# Altium schematic sheet 02 BLOCK DIAGRAM.SchDoc
size A2; ApprovedBy: DNP; CheckedBy: DNP; Author: DNP; CompanyName: Google LLC; DrawnBy: DNP; Organization: Google LLC; Address1: 1600 Amphitheatre Parkway; Address2: Mountain View, CA 94043; Address3: DNP; Address4: DNP; DocumentNumber: 2; SheetNumber: 2; SheetTotal: 17; VersionControl_RevNumber: DNP; IsUserConfigurable: DNP; Time: DNP; ImagePath: DNP; Rule: DNP; ProjectName: Enterprise; Application_BuildNumber: DNP
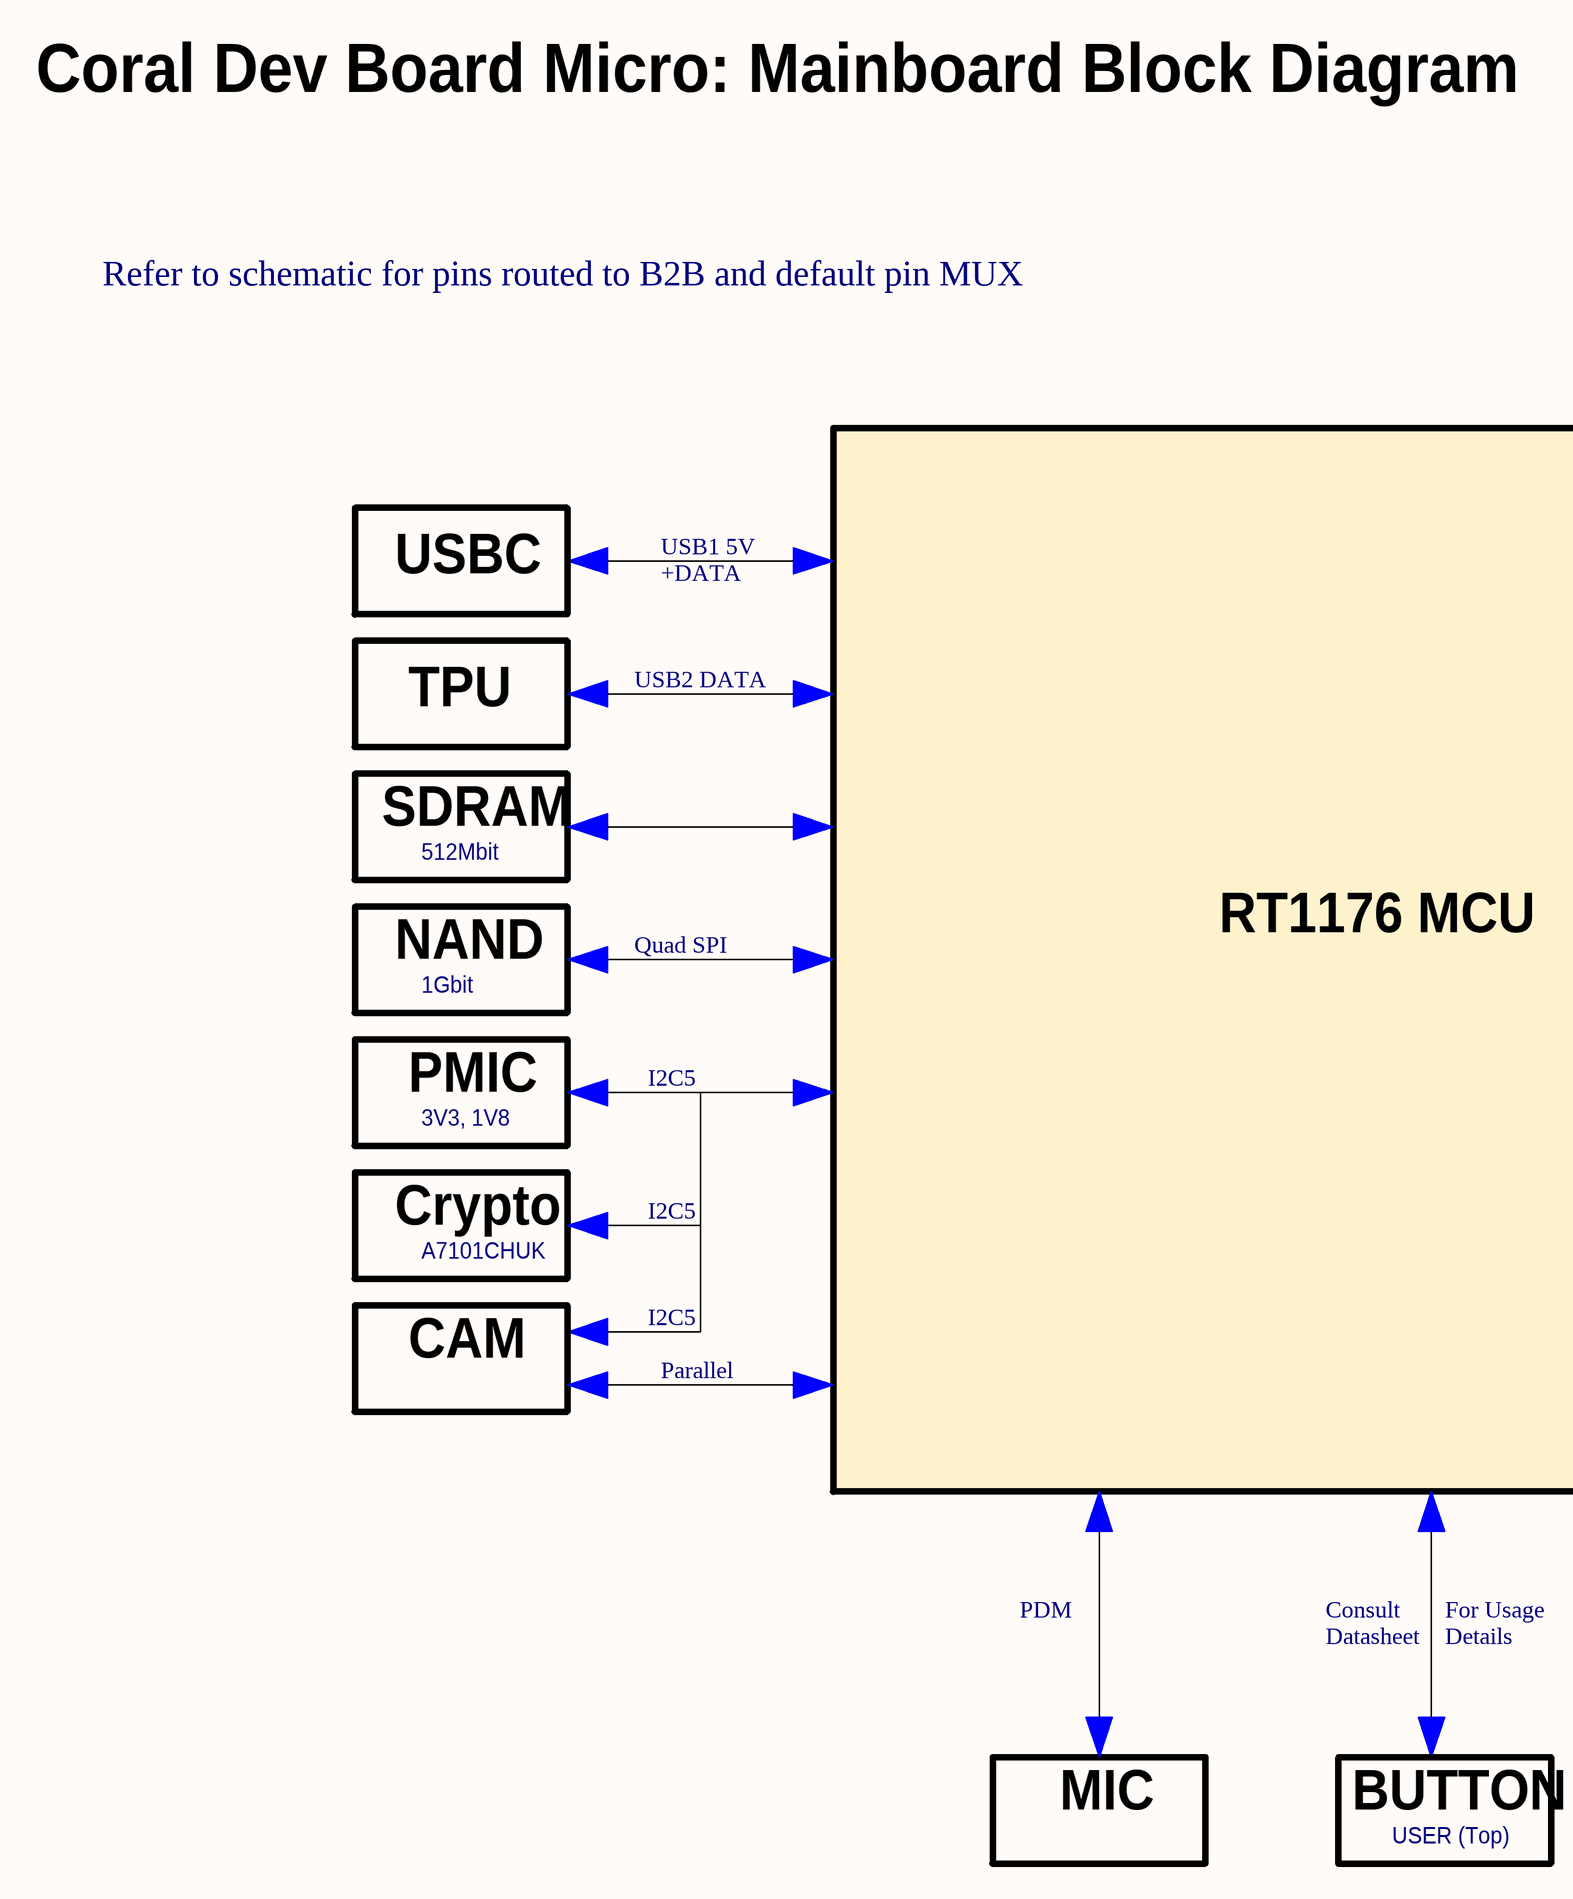
[diagram p0: 02 BLOCK DIAGRAM.SchDoc, left]
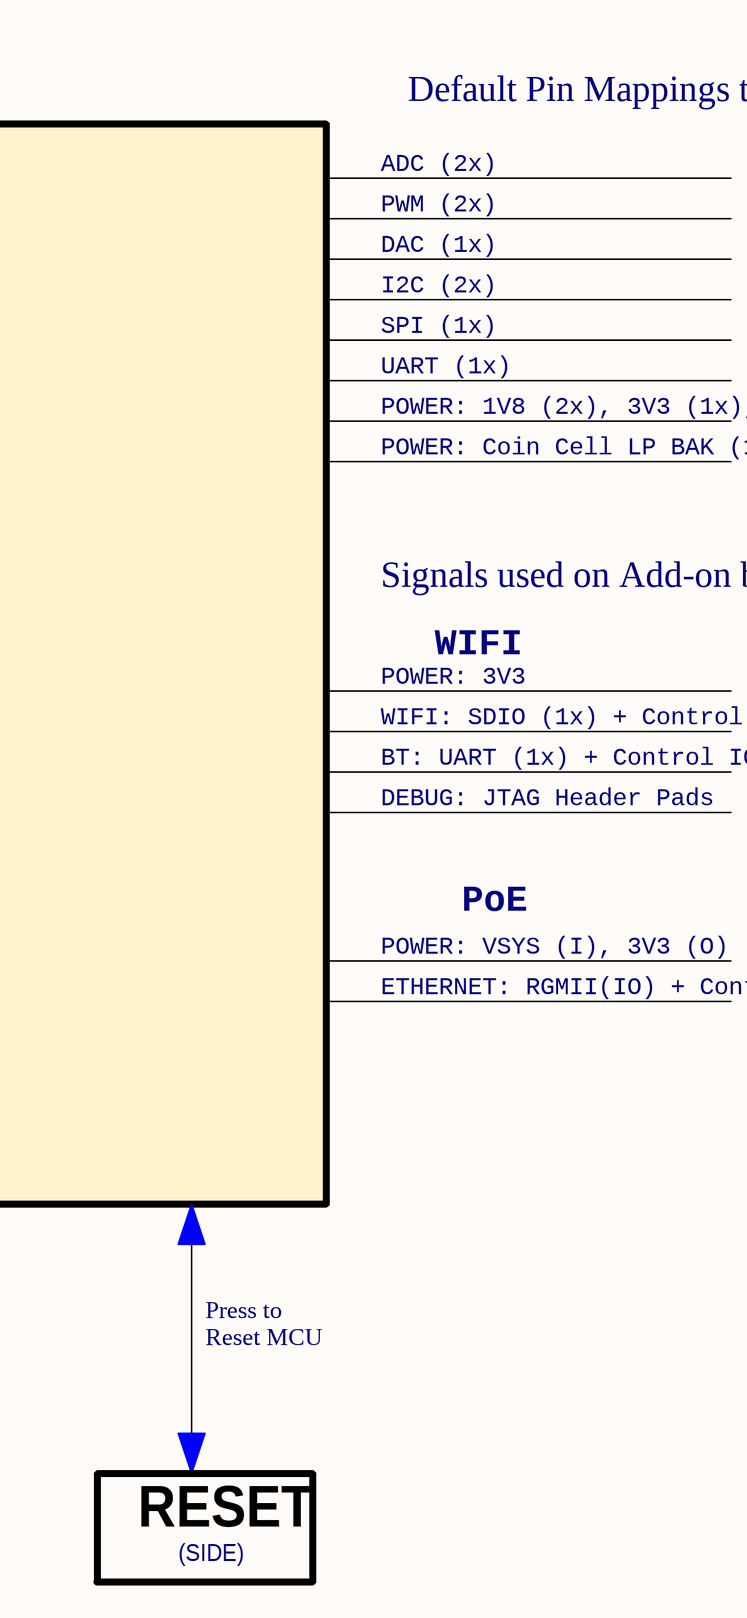
[diagram p1: 02 BLOCK DIAGRAM.SchDoc, right]

## Notes on the sheet
- Coral Dev Board Micro: Mainboard Block Diagram
- Refer to schematic for pins routed to B2B and default pin MUX
- Default Pin Mappings to Header
- ADC (2x)
- PWM (2x)
- USBC
- USB1 5V
- +DATA
- DAC (1x)
- I2C (2x)
- SPI (1x)
- TPU
- USB2 DATA
- UART (1x)
- POWER: 1V8 (2x), 3V3 (1x), VSYS 5V (1x)
- POWER: Coin Cell LP BAK (1x)
- SDRAM
- 512Mbit
- Signals used on Add-on boards at Release Time
- NAND
- Quad SPI
- RT1176 MCU
- POWER: 3V3
- WIFI
- 1Gbit
- WIFI: SDIO (1x) + Control IO
- PMIC
- I2C5
- BT: UART (1x) + Control IO
- DEBUG: JTAG Header Pads
- 3V3, 1V8
- Crypto
- POWER: VSYS (I), 3V3 (O)
- PoE
- A7101CHUK
- ETHERNET: RGMII(IO) + Control IO
- CAM
- Parallel
- PDM
- Consult
- Datasheet
- For Usage
- Details
- Press to
- Reset MCU
- MIC
- BUTTON
- USER (Top)
- RESET
- (SIDE)
- Project:
- Engineer:
- Date:
- File:
- Revision:
- Sheet
- of